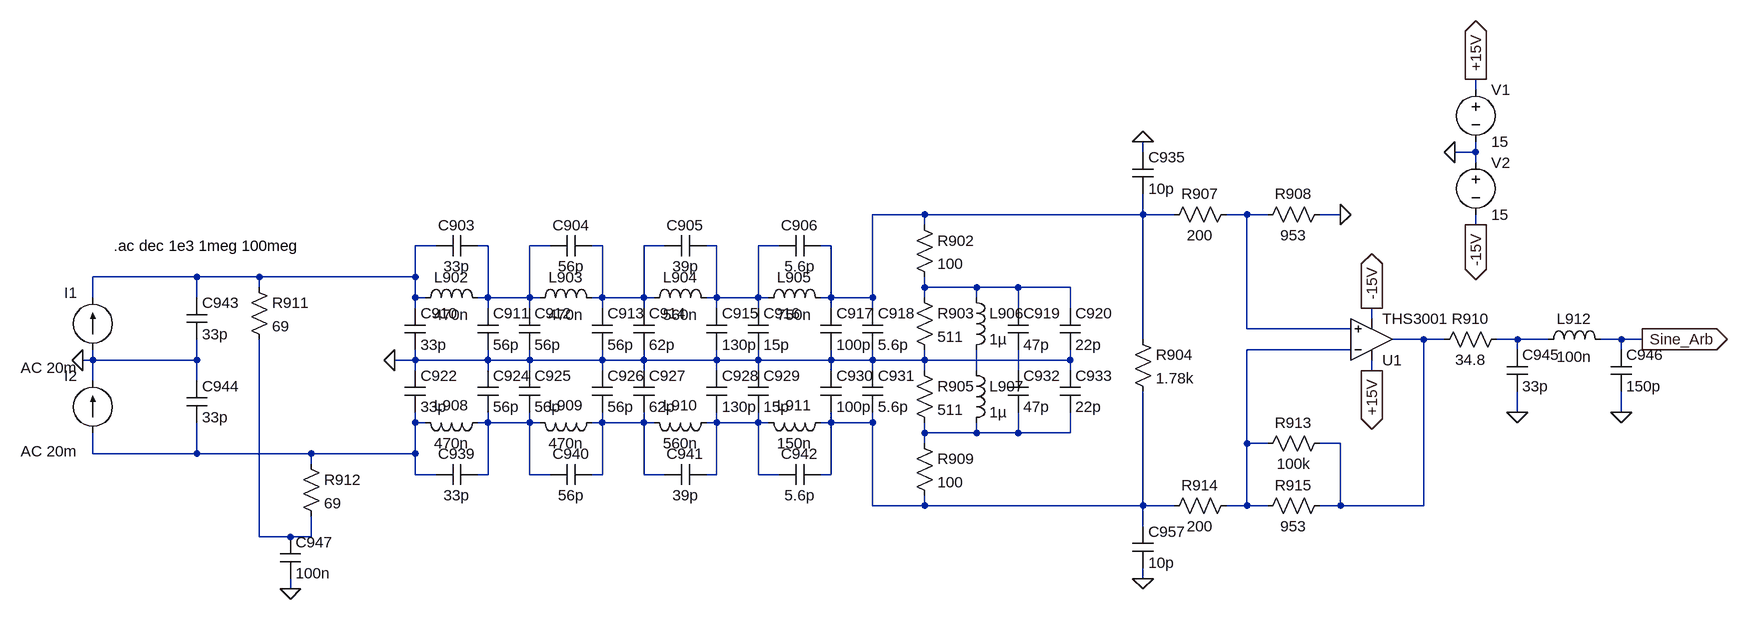
[diagram p0: schematic Agilent_33220A_DAC_reconstr.asc]
Agilent_33220A_DAC_reconstr.asc, the LTspice schematic file:
Version 4
SHEET 1 2144 680
WIRE 1712 -240 1712 -256
WIRE 1200 -144 1200 -160
WIRE 1712 -144 1712 -160
WIRE 1712 -144 1680 -144
WIRE 1712 -128 1712 -144
WIRE 864 -48 784 -48
WIRE 1200 -48 1200 -80
WIRE 1200 -48 864 -48
WIRE 1248 -48 1200 -48
WIRE 1360 -48 1328 -48
WIRE 1392 -48 1360 -48
WIRE 1504 -48 1472 -48
WIRE 864 -32 864 -48
WIRE 1712 -32 1712 -48
WIRE 112 0 80 0
WIRE 192 0 176 0
WIRE 288 0 256 0
WIRE 368 0 352 0
WIRE 464 0 432 0
WIRE 544 0 528 0
WIRE 640 0 608 0
WIRE 720 0 704 0
WIRE -256 48 -416 48
WIRE -160 48 -256 48
WIRE 80 48 80 0
WIRE 80 48 -160 48
WIRE -160 64 -160 48
WIRE 864 64 864 48
WIRE 944 64 864 64
WIRE 1008 64 944 64
WIRE 1088 64 1008 64
WIRE -416 80 -416 48
WIRE -256 80 -256 48
WIRE 80 80 80 48
WIRE 96 80 80 80
WIRE 192 80 192 0
WIRE 192 80 176 80
WIRE 256 80 256 0
WIRE 256 80 192 80
WIRE 272 80 256 80
WIRE 368 80 368 0
WIRE 368 80 352 80
WIRE 432 80 432 0
WIRE 432 80 368 80
WIRE 448 80 432 80
WIRE 544 80 544 0
WIRE 544 80 528 80
WIRE 608 80 608 0
WIRE 608 80 544 80
WIRE 624 80 608 80
WIRE 720 80 720 0
WIRE 720 80 704 80
WIRE 784 80 784 -48
WIRE 784 80 720 80
WIRE 864 80 864 64
WIRE 944 80 944 64
WIRE 80 96 80 80
WIRE 192 96 192 80
WIRE 256 96 256 80
WIRE 368 96 368 80
WIRE 432 96 432 80
WIRE 544 96 544 80
WIRE 608 96 608 80
WIRE 720 96 720 80
WIRE 784 96 784 80
WIRE 1008 96 1008 64
WIRE 1088 96 1088 64
WIRE 1552 112 1552 96
WIRE 1360 128 1360 -48
WIRE 1520 128 1360 128
WIRE 1200 144 1200 -48
WIRE 1632 144 1584 144
WIRE 1664 144 1632 144
WIRE 1776 144 1744 144
WIRE 1824 144 1776 144
WIRE 1936 144 1904 144
WIRE 1968 144 1936 144
WIRE 1520 160 1360 160
WIRE 1776 160 1776 144
WIRE 1936 160 1936 144
WIRE -416 176 -416 160
WIRE -416 176 -432 176
WIRE -256 176 -256 144
WIRE -256 176 -416 176
WIRE 80 176 80 160
WIRE 80 176 48 176
WIRE 192 176 192 160
WIRE 192 176 80 176
WIRE 256 176 256 160
WIRE 256 176 192 176
WIRE 368 176 368 160
WIRE 368 176 256 176
WIRE 432 176 432 160
WIRE 432 176 368 176
WIRE 544 176 544 160
WIRE 544 176 432 176
WIRE 608 176 608 160
WIRE 608 176 544 176
WIRE 720 176 720 160
WIRE 720 176 608 176
WIRE 784 176 784 160
WIRE 784 176 720 176
WIRE 864 176 864 160
WIRE 864 176 784 176
WIRE 1088 176 1088 160
WIRE 1088 176 864 176
WIRE 80 192 80 176
WIRE 192 192 192 176
WIRE 256 192 256 176
WIRE 368 192 368 176
WIRE 432 192 432 176
WIRE 544 192 544 176
WIRE 608 192 608 176
WIRE 720 192 720 176
WIRE 784 192 784 176
WIRE 864 192 864 176
WIRE 944 192 944 160
WIRE 1008 192 1008 160
WIRE 1088 192 1088 176
WIRE 1552 192 1552 176
WIRE -416 208 -416 176
WIRE -256 208 -256 176
WIRE 1776 256 1776 224
WIRE 1936 256 1936 224
WIRE 80 272 80 256
WIRE 96 272 80 272
WIRE 192 272 192 256
WIRE 192 272 176 272
WIRE 256 272 256 256
WIRE 256 272 192 272
WIRE 272 272 256 272
WIRE 368 272 368 256
WIRE 368 272 352 272
WIRE 432 272 432 256
WIRE 432 272 368 272
WIRE 448 272 432 272
WIRE 544 272 544 256
WIRE 544 272 528 272
WIRE 608 272 608 256
WIRE 608 272 544 272
WIRE 624 272 608 272
WIRE 720 272 720 256
WIRE 720 272 704 272
WIRE 784 272 784 256
WIRE 784 272 720 272
WIRE 864 288 864 272
WIRE 944 288 944 272
WIRE 944 288 864 288
WIRE 1008 288 1008 256
WIRE 1008 288 944 288
WIRE 1088 288 1088 256
WIRE 1088 288 1008 288
WIRE 864 304 864 288
WIRE 1360 304 1360 160
WIRE 1392 304 1360 304
WIRE 1504 304 1472 304
WIRE -416 320 -416 288
WIRE -256 320 -256 272
WIRE -256 320 -416 320
WIRE -80 320 -256 320
WIRE 80 320 80 272
WIRE 80 320 -80 320
WIRE -80 336 -80 320
WIRE 80 352 80 320
WIRE 112 352 80 352
WIRE 192 352 192 272
WIRE 192 352 176 352
WIRE 256 352 256 272
WIRE 288 352 256 352
WIRE 368 352 368 272
WIRE 368 352 352 352
WIRE 432 352 432 272
WIRE 464 352 432 352
WIRE 544 352 544 272
WIRE 544 352 528 352
WIRE 608 352 608 272
WIRE 640 352 608 352
WIRE 720 352 720 272
WIRE 720 352 704 352
WIRE 784 400 784 272
WIRE 864 400 864 384
WIRE 864 400 784 400
WIRE 1200 400 1200 224
WIRE 1200 400 864 400
WIRE 1248 400 1200 400
WIRE 1360 400 1360 304
WIRE 1360 400 1328 400
WIRE 1392 400 1360 400
WIRE 1504 400 1504 304
WIRE 1504 400 1472 400
WIRE 1632 400 1632 144
WIRE 1632 400 1504 400
WIRE 1200 432 1200 400
WIRE -160 448 -160 144
WIRE -112 448 -160 448
WIRE -80 448 -80 416
WIRE -80 448 -112 448
WIRE 1200 512 1200 496
WIRE -112 528 -112 512
FLAG -432 176 0
FLAG 1200 -160 0
FLAG 1200 512 0
FLAG 1504 -48 0
FLAG 1776 256 0
FLAG 1936 256 0
FLAG 1968 144 Sine_Arb
IOPIN 1968 144 Out
FLAG 1680 -144 0
FLAG 1712 -256 +15V
IOPIN 1712 -256 Out
FLAG 1712 -32 -15V
IOPIN 1712 -32 Out
FLAG 1552 96 -15V
IOPIN 1552 96 Out
FLAG 1552 192 +15V
IOPIN 1552 192 Out
FLAG 48 176 0
FLAG -112 528 0
SYMBOL cap 64 96 R0
SYMATTR InstName C910
SYMATTR Value 33p
SYMBOL cap 64 192 R0
SYMATTR InstName C922
SYMATTR Value 33p
SYMBOL ind 80 96 R270
WINDOW 0 32 56 VTop 2
WINDOW 3 5 56 VBottom 2
SYMATTR InstName L902
SYMATTR Value 470n
SYMBOL ind 192 256 R90
WINDOW 0 5 56 VBottom 2
WINDOW 3 32 56 VTop 2
SYMATTR InstName L908
SYMATTR Value 470n
SYMBOL cap 176 -16 R90
WINDOW 0 0 32 VBottom 2
WINDOW 3 32 32 VTop 2
SYMATTR InstName C903
SYMATTR Value 33p
SYMBOL cap 176 336 R90
WINDOW 0 0 32 VBottom 2
WINDOW 3 32 32 VTop 2
SYMATTR InstName C939
SYMATTR Value 33p
SYMBOL cap 176 96 R0
SYMATTR InstName C911
SYMATTR Value 56p
SYMBOL cap 176 192 R0
SYMATTR InstName C924
SYMATTR Value 56p
SYMBOL cap 240 96 R0
SYMATTR InstName C912
SYMATTR Value 56p
SYMBOL cap 240 192 R0
SYMATTR InstName C925
SYMATTR Value 56p
SYMBOL ind 256 96 R270
WINDOW 0 32 56 VTop 2
WINDOW 3 5 56 VBottom 2
SYMATTR InstName L903
SYMATTR Value 470n
SYMBOL ind 368 256 R90
WINDOW 0 5 56 VBottom 2
WINDOW 3 32 56 VTop 2
SYMATTR InstName L909
SYMATTR Value 470n
SYMBOL cap 352 -16 R90
WINDOW 0 0 32 VBottom 2
WINDOW 3 32 32 VTop 2
SYMATTR InstName C904
SYMATTR Value 56p
SYMBOL cap 352 336 R90
WINDOW 0 0 32 VBottom 2
WINDOW 3 32 32 VTop 2
SYMATTR InstName C940
SYMATTR Value 56p
SYMBOL cap 352 96 R0
SYMATTR InstName C913
SYMATTR Value 56p
SYMBOL cap 352 192 R0
SYMATTR InstName C926
SYMATTR Value 56p
SYMBOL cap 416 96 R0
SYMATTR InstName C914
SYMATTR Value 62p
SYMBOL cap 416 192 R0
SYMATTR InstName C927
SYMATTR Value 62p
SYMBOL ind 432 96 R270
WINDOW 0 32 56 VTop 2
WINDOW 3 5 56 VBottom 2
SYMATTR InstName L904
SYMATTR Value 560n
SYMBOL ind 544 256 R90
WINDOW 0 5 56 VBottom 2
WINDOW 3 32 56 VTop 2
SYMATTR InstName L910
SYMATTR Value 560n
SYMBOL cap 528 -16 R90
WINDOW 0 0 32 VBottom 2
WINDOW 3 32 32 VTop 2
SYMATTR InstName C905
SYMATTR Value 39p
SYMBOL cap 528 336 R90
WINDOW 0 0 32 VBottom 2
WINDOW 3 32 32 VTop 2
SYMATTR InstName C941
SYMATTR Value 39p
SYMBOL cap 528 96 R0
SYMATTR InstName C915
SYMATTR Value 130p
SYMBOL cap 528 192 R0
SYMATTR InstName C928
SYMATTR Value 130p
SYMBOL cap 592 96 R0
SYMATTR InstName C916
SYMATTR Value 15p
SYMBOL cap 592 192 R0
SYMATTR InstName C929
SYMATTR Value 15p
SYMBOL ind 608 96 R270
WINDOW 0 32 56 VTop 2
WINDOW 3 5 56 VBottom 2
SYMATTR InstName L905
SYMATTR Value 750n
SYMBOL ind 720 256 R90
WINDOW 0 5 56 VBottom 2
WINDOW 3 32 56 VTop 2
SYMATTR InstName L911
SYMATTR Value 150n
SYMBOL cap 704 -16 R90
WINDOW 0 0 32 VBottom 2
WINDOW 3 32 32 VTop 2
SYMATTR InstName C906
SYMATTR Value 5.6p
SYMBOL cap 704 336 R90
WINDOW 0 0 32 VBottom 2
WINDOW 3 32 32 VTop 2
SYMATTR InstName C942
SYMATTR Value 5.6p
SYMBOL cap 704 96 R0
SYMATTR InstName C917
SYMATTR Value 100p
SYMBOL cap 704 192 R0
SYMATTR InstName C930
SYMATTR Value 100p
SYMBOL cap 768 96 R0
SYMATTR InstName C918
SYMATTR Value 5.6p
SYMBOL cap 768 192 R0
SYMATTR InstName C931
SYMATTR Value 5.6p
SYMBOL res 848 64 R0
SYMATTR InstName R903
SYMATTR Value 511
SYMBOL res 848 176 R0
SYMATTR InstName R905
SYMATTR Value 511
SYMBOL res 848 -48 R0
SYMATTR InstName R902
SYMATTR Value 100
SYMBOL res 848 288 R0
SYMATTR InstName R909
SYMATTR Value 100
SYMBOL ind 928 64 R0
SYMATTR InstName L906
SYMATTR Value 1µ
SYMBOL ind 928 176 R0
SYMATTR InstName L907
SYMATTR Value 1µ
SYMBOL cap 992 96 R0
SYMATTR InstName C919
SYMATTR Value 47p
SYMBOL cap 992 192 R0
SYMATTR InstName C932
SYMATTR Value 47p
SYMBOL cap 1072 96 R0
SYMATTR InstName C920
SYMATTR Value 22p
SYMBOL cap 1072 192 R0
SYMATTR InstName C933
SYMATTR Value 22p
SYMBOL res 1184 128 R0
SYMATTR InstName R904
SYMATTR Value 1.78k
SYMBOL cap 1184 432 R0
SYMATTR InstName C957
SYMATTR Value 10p
SYMBOL cap 1184 -144 R0
SYMATTR InstName C935
SYMATTR Value 10p
SYMBOL res 1344 -64 R90
WINDOW 0 0 56 VBottom 2
WINDOW 3 32 56 VTop 2
SYMATTR InstName R907
SYMATTR Value 200
SYMBOL res 1344 384 R90
WINDOW 0 0 56 VBottom 2
WINDOW 3 32 56 VTop 2
SYMATTR InstName R914
SYMATTR Value 200
SYMBOL res 1488 -64 R90
WINDOW 0 0 56 VBottom 2
WINDOW 3 32 56 VTop 2
SYMATTR InstName R908
SYMATTR Value 953
SYMBOL res 1488 384 R90
WINDOW 0 0 56 VBottom 2
WINDOW 3 32 56 VTop 2
SYMATTR InstName R915
SYMATTR Value 953
SYMBOL res 1488 288 R90
WINDOW 0 0 56 VBottom 2
WINDOW 3 32 56 VTop 2
SYMATTR InstName R913
SYMATTR Value 100k
SYMBOL THS3001 1552 208 M180
SYMATTR InstName U1
SYMBOL res 1760 128 R90
WINDOW 0 0 56 VBottom 2
WINDOW 3 32 56 VTop 2
SYMATTR InstName R910
SYMATTR Value 34.8
SYMBOL cap 1760 160 R0
SYMATTR InstName C945
SYMATTR Value 33p
SYMBOL cap 1920 160 R0
SYMATTR InstName C946
SYMATTR Value 150p
SYMBOL ind 1808 160 R270
WINDOW 0 32 56 VTop 2
WINDOW 3 5 56 VBottom 2
SYMATTR InstName L912
SYMATTR Value 100n
SYMBOL cap -272 80 R0
SYMATTR InstName C943
SYMATTR Value 33p
SYMBOL cap -272 208 R0
SYMATTR InstName C944
SYMATTR Value 33p
SYMBOL res -176 48 R0
SYMATTR InstName R911
SYMATTR Value 69
SYMBOL res -96 320 R0
SYMATTR InstName R912
SYMATTR Value 69
SYMBOL current -416 160 R180
WINDOW 0 24 88 Left 2
WINDOW 3 24 0 Left 2
WINDOW 123 24 -28 Left 2
WINDOW 39 0 0 Left 2
SYMATTR InstName I1
SYMATTR Value ""
SYMATTR Value2 AC 20m
SYMBOL current -416 288 R180
WINDOW 0 24 88 Left 2
WINDOW 3 24 0 Left 2
WINDOW 123 24 -28 Left 2
WINDOW 39 0 0 Left 2
SYMATTR InstName I2
SYMATTR Value ""
SYMATTR Value2 AC 20m
SYMBOL voltage 1712 -256 R0
WINDOW 123 0 0 Left 2
WINDOW 39 0 0 Left 2
SYMATTR InstName V1
SYMATTR Value 15
SYMBOL voltage 1712 -144 R0
WINDOW 123 0 0 Left 2
WINDOW 39 0 0 Left 2
SYMATTR InstName V2
SYMATTR Value 15
SYMBOL cap -128 448 R0
SYMATTR InstName C947
SYMATTR Value 100n
TEXT -384 0 Left 2 !.ac dec 1e3 1meg 100meg

The netlist it stands for:
* Agilent_33220A_DAC_reconstr.asc
C910 N003 0 33p
C922 0 N013 33p
L902 N003 N004 470n
L908 N014 N013 470n
C903 N004 N003 33p
C939 N014 N013 33p
C911 N004 0 56p
C924 0 N014 56p
C912 N004 0 56p
C925 0 N014 56p
L903 N004 N005 470n
L909 N015 N014 470n
C904 N005 N004 56p
C940 N015 N014 56p
C913 N005 0 56p
C926 0 N015 56p
C914 N005 0 62p
C927 0 N015 62p
L904 N005 N006 560n
L910 N016 N015 560n
C905 N006 N005 39p
C941 N016 N015 39p
C915 N006 0 130p
C928 0 N016 130p
C916 N006 0 15p
C929 0 N016 15p
L905 N006 N001 750n
L911 N017 N016 150n
C906 N001 N006 5.6p
C942 N017 N016 5.6p
C917 N001 0 100p
C930 0 N017 100p
C918 N001 0 5.6p
C931 0 N017 5.6p
R903 N007 0 511
R905 0 N018 511
R902 N001 N007 100
R909 N018 N017 100
L906 N007 N011 1µ
L907 N011 N018 1µ
C919 N007 N012 47p
C932 N012 N018 47p
C920 N007 0 22p
C933 0 N018 22p
R904 N001 N017 1.78k
C957 N017 0 10p
C935 0 N001 10p
R907 N002 N001 200
R914 N010 N017 200
R908 0 N002 953
R915 N008 N010 953
R913 N008 N010 100k
* U1: THS3001 (symbol THS3001 not available, pins judged from their places): In+=N002 In-=N010 V+=+15V V-=-15V OUT=N008
R910 N009 N008 34.8
C945 N009 0 33p
C946 Sine_Arb 0 150p
L912 N009 Sine_Arb 100n
C943 N003 0 33p
C944 0 N013 33p
R911 N003 N019 69
R912 N013 N019 69
I1 0 N003 AC 20m
I2 N013 0 AC 20m
V1 +15V 0 15
V2 0 -15V 15
C947 N019 0 100n
.ac dec 1e3 1meg 100meg
.backanno
.end